# EAGLE design 8LedBoard (EAGLE 7.5.0)
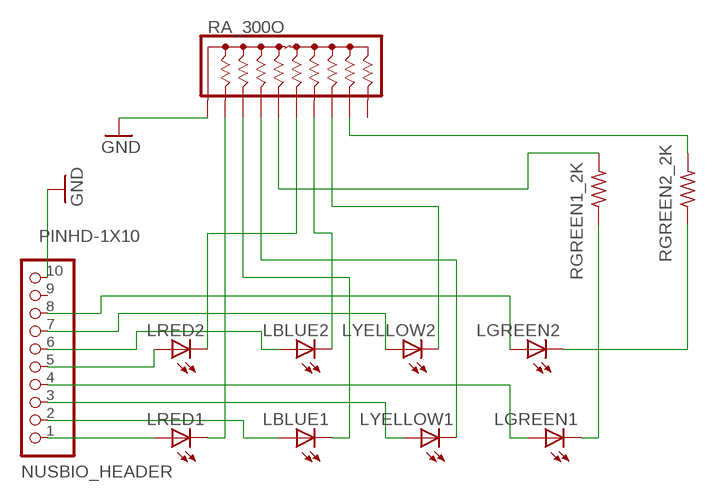
[diagram p0: schematic, sheet 1]

## Parts
LBLUE1  LED5MM  [LED5MM]
LBLUE2  LED5MM  [LED5MM]
LGREEN1  LED5MM  [LED5MM]
LGREEN2  LED5MM  [LED5MM]
LRED1  LED5MM  [LED5MM]
LRED2  LED5MM  [LED5MM]
LYELLOW1  LED5MM  [LED5MM]
LYELLOW2  LED5MM  [LED5MM]
NUSBIO_HEADER  PINHD-1X10  [1X10-BIG]
RA_300O  4610X  [SIP10]
RGREEN1_2K  R-US_0207/10  [0207/10]
RGREEN2_2K  R-US_0207/10  [0207/10]

## Nets
GND: NUSBIO_HEADER.10 RA_300O.1
N$2: LGREEN2.A NUSBIO_HEADER.8
N$3: LRED1.A NUSBIO_HEADER.1
N$4: LBLUE1.A NUSBIO_HEADER.2
N$5: LYELLOW1.A NUSBIO_HEADER.3
N$6: LGREEN1.A NUSBIO_HEADER.4
N$7: LRED2.A NUSBIO_HEADER.5
N$8: LBLUE2.A NUSBIO_HEADER.6
N$9: LYELLOW2.A NUSBIO_HEADER.7
N$10: LRED1.K(C) RA_300O.2
N$11: LBLUE1.K(C) RA_300O.3
N$12: LYELLOW1.K(C) RA_300O.4
N$14: LRED2.K(C) RA_300O.6
N$15: LBLUE2.K(C) RA_300O.7
N$16: LYELLOW2.K(C) RA_300O.8
N$17: LGREEN1.K(C) RGREEN1_2K.1
N$18: RA_300O.5 RGREEN1_2K.2
N$19: LGREEN2.K(C) RGREEN2_2K.1
N$20: RA_300O.9 RGREEN2_2K.2
Unconnected: NUSBIO_HEADER.9 RA_300O.10

## Library data of the parts
LBLUE1 LBLUE2 LGREEN1 LGREEN2 LRED1 LRED2 LYELLOW1 LYELLOW2 = adafruit:LED: LED OSRAM: - CHIPLED LG R971, LG N971, LY N971, LG Q971, LY Q971, LO R971, LY R971 LH N974, LH R974 LS Q976, LO Q976, LY Q976 LO Q996 - Hyper CHIPLED LW Q18S LB Q993, LB Q99A, LB R99A - SideLED LS A670, LO A670, LY A670, LG A670, LP A670 LB A673, LV A673, LT A673, LW A673 LH A674 LY A675 LS A676, LA A676, LO A676, LY A676, LW A676 LS A679, LY A679, LG A679 - Hyper Micro SIDELED® LS Y876, LA Y876, LO Y876, LY Y876 LT Y87S - SmartLED LW L88C, LW L88S LB L89C, LB L89S, LG L890 LS L89K, LO L89K, LY L89K LS L896, LA L896, LO L896, LY L896 - TOPLED LS T670, LO T670, LY T670, LG T670, LP T670 LSG T670, LSP T670, LSY T670, LOP T670, LYG T670 LG T671, LOG T671, LSG T671 LB T673, LV T673, LT T673, LW T673 LH T674 LS T676, LA T676, LO T676, LY T676, LB T676, LH T676, LSB T676, LW T676 LB T67C, LV T67C, LT T67C, LS T67K, LO T67K, LY T67K, LW E67C LS E67B, LA E67B, LO E67B, LY E67B, LB E67C, LV E67C, LT E67C LW T67C LS T679, LY T679, LG T679 LS T770, LO T770, LY T770, LG T770, LP T770 LB T773, LV T773, LT T773, LW T773 LH T774 LS E675, LA E675, LY E675, LS T675 LS T776, LA T776, LO T776, LY T776, LB T776 LHGB T686 LT T68C, LB T68C - Hyper Mini TOPLED® LB M676 - Mini TOPLED Santana® LG M470 LS M47K, LO M47K, LY M47K Source: http://www.osram.convergy.de/
NUSBIO_HEADER = adafruit:PINHD-1X10: Pin header 1x10 0.1" spacing With round pins
RA_300O = resistor-sip:4610X: Bourns 4600X Series - Thick Film Conformal SIPs 4610X-101 Resistor Network Configuration: 101 (Bussed Resistors) Resistance range: 10 ohms to 10 Megaohms Maximum Operating Voltage: 100V Source: http://www.bourns.com/ProductLine.aspx?name=standard_thick_film_networks PDF: http://www.bourns.com/data/global/pdfs/4600X.pdf
RGREEN1_2K RGREEN2_2K = adafruit:R-US_: RESISTOR, American symbol

## Board
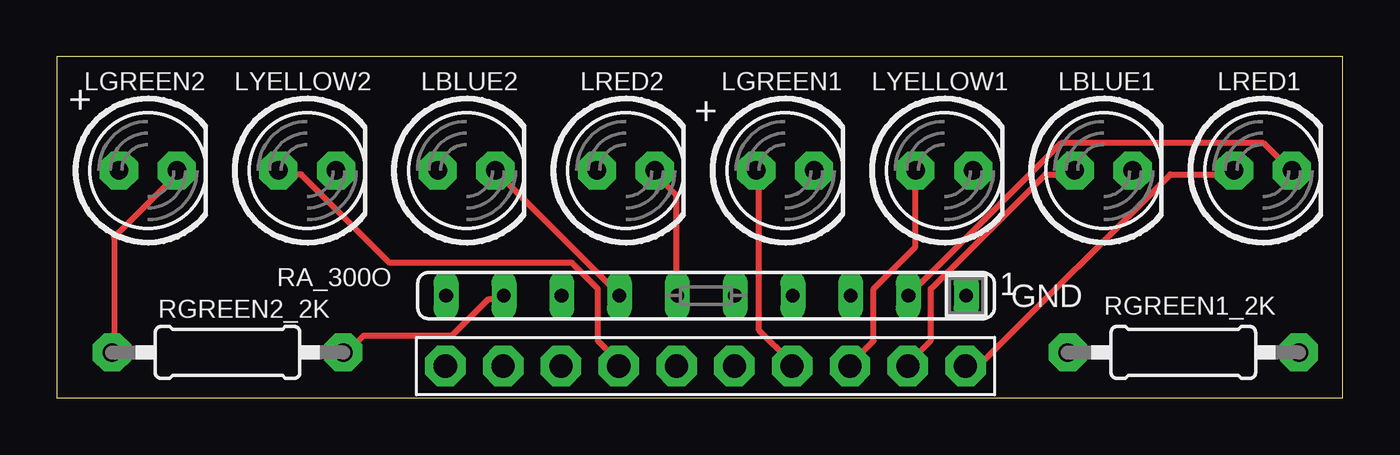
[diagram p1: board, top side]
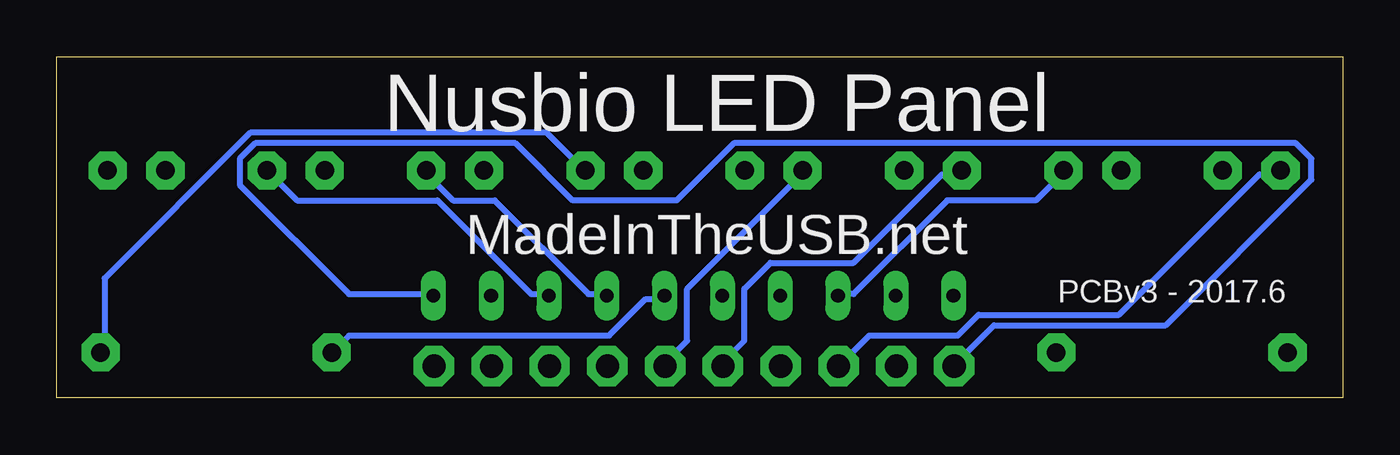
[diagram p2: board, bottom side, seen from below]

Size 56.5 x 15 mm. Coordinates in mm from the lower left corner, seen from the top.
Outline: 0,0 56.5,0 56.5,15 0,15 0,0
Copper layers (1*16): Top 0.035mm / dielectric 1.5mm / Bottom 0.035mm
Design rules "default": minimum track width 10mil, minimum drill 24mil, track to track 8mil, track to pad 8mil, pad to pad 8mil, via to via 8mil, smd to smd 8mil, copper to edge 40mil, drill to drill 8mil, minimum pad ring 10mil, minimum via ring 8mil, stop-mask expansion 4mil, vias tented up to drill 0mil, thermal gap 10mil

### Footprints (pad centres in the part's own frame; a part is rotated, then mirrored left to right if it is on the bottom)
LED5MM = drill 0.813 pad 1.676 octagon: A -1.27,0; K 1.27,0
1X10-BIG = drill 1.016 pad 1.778 octagon: 1 -11.43,0; 2 -8.89,0; 3 -6.35,0; 4 -3.81,0; 5 -1.27,0; 6 1.27,0; 7 3.81,0; 8 6.35,0; 9 8.89,0; 10 11.43,0
SIP10 = drill 0.6 long: 1 -11.46,0; 2 -8.92,0; 3 -6.38,0; 4 -3.84,0; 5 -1.3,0; 6 1.24,0; 7 3.78,0; 8 6.32,0; 9 8.86,0; 10 11.4,0
0207/10 = drill 0.813 pad 1.676 octagon: 1 -5.08,0; 2 5.08,0

### Placement (x,y rotation side)
LBLUE1  46,10 0 top
LBLUE2  18,10 0 top
LGREEN1  32,10 0 top
LGREEN2  4,10 0 top
LRED1  53,10 0 top
LRED2  25,10 0 top
LYELLOW1  39,10 0 top
LYELLOW2  11,10 0 top
NUSBIO_HEADER  28.5,1.4 180 top
RA_300O  28.5,4.5 180 top
RGREEN1_2K  49.5,2 180 top
RGREEN2_2K  7.5,2 0 top

### Tracks (layer width: path | path; a pad name or v marks a point on that pad's centre or on a via)
GND
  Bottom 0.254: RA_300O.1 40.01,4.57 43.66,4.57 48.46,9.37 48.46,10.52 47.78,11.2 36.35,11.2 33.83,8.69 29.26,8.69 26.75,11.2 2.06,11.2 1.37,10.52 1.37,9.6 7.77,3.2 15.32,3.2 16.92,1.6 NUSBIO_HEADER.10
N$2
  Bottom 0.254: LGREEN2.A 2.74,9.83 3.66,9.83 9.83,3.66 16,3.66 16.92,2.74 20.8,2.74 21.95,1.6 NUSBIO_HEADER.8
N$3
  Top 0.254: LRED1.A 51.66,9.83 48.92,9.83 40.69,1.6 40.01,1.6 NUSBIO_HEADER.1
N$4
  Top 0.254: LBLUE1.A 44.58,9.83 43.43,9.83 38.41,4.8 38.41,2.52 37.49,1.6 NUSBIO_HEADER.2
N$5
  Top 0.254: LYELLOW1.A 37.72,9.83 37.72,6.63 35.89,4.8 35.89,2.52 34.98,1.6 NUSBIO_HEADER.3
N$6
  Top 0.254: LGREEN1.A 30.86,9.83 30.86,2.97 32.23,1.6 NUSBIO_HEADER.4
N$7
  Bottom 0.254: LRED2.A 23.77,9.83 28.8,4.8 28.8,2.52 29.72,1.6 NUSBIO_HEADER.5
N$8
  Bottom 0.254: LBLUE2.A 16.92,9.83 17.6,9.83 21.49,5.94 25.15,5.94 26.29,4.8 26.29,2.52 27.2,1.6 NUSBIO_HEADER.6
N$9
  Top 0.254: LYELLOW2.A 9.83,9.83 10.74,9.83 14.63,5.94 22.63,5.94 23.77,4.8 23.77,2.52 24.69,1.6 NUSBIO_HEADER.7
N$10
  Top 0.254: RA_300O.2 37.49,4.57 44.12,11.2 53.03,11.2 54.18,10.06 LRED1.K
N$11
  Bottom 0.254: RA_300O.3 34.98,4.57 35.66,4.57 39.78,8.69 45.95,8.69 47.09,9.83 LBLUE1.K
N$12
  Bottom 0.254: RA_300O.4 32.46,4.57 33.15,4.57 37.26,8.69 39.09,8.69 40.23,9.83 LYELLOW1.K
N$14
  Top 0.254: RA_300O.6 27.2,4.57 27.2,8.91 26.29,9.83 LRED2.K
N$15
  Top 0.254: RA_300O.7 24.69,4.57 19.43,9.83 LBLUE2.K
N$16
  Bottom 0.254: RA_300O.8 22.17,4.57 21.49,4.57 17.37,8.69 13.49,8.69 12.34,9.83 LYELLOW2.K
N$17
  Bottom 0.254: RGREEN1_2K.1 54.41,2.06 54.41,5.26 48.01,11.66 34.98,11.66 33.38,10.06 LGREEN1.K
N$18
  Bottom 0.254: RA_300O.5 29.95,4.34 30.63,4.34 32.23,2.74 43.66,2.74 44.35,2.06 RGREEN1_2K.2
N$19
  Top 0.254: RGREEN2_2K.1 2.52,2.06 2.52,7.09 5.26,9.83 LGREEN2.K
N$20
  Top 0.254: RA_300O.9 19.43,4.34 18.97,4.34 17.37,2.74 13.49,2.74 12.8,2.06 RGREEN2_2K.2

### Text on the board
tNames: + | + | GND
bNames: Nusbio LED Panel | MadeInTheUSB.net | PCBv3 - 2017.6